# Altium schematic sheet backlight_control.SchDoc
size A4; SheetNumber: 7; SheetTotal: 13
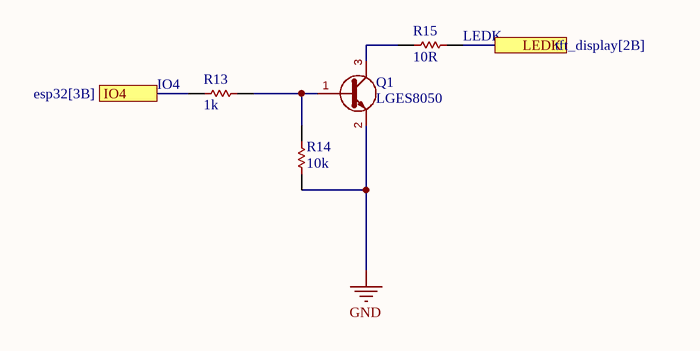
[diagram p0: backlight_control.SchDoc]

## Parts
Q1  LGES8050  [FP-SS8050-G-IPC_A]
R13  1k  [RESC2013X70X40NL20T20]
R14  10k  [RESC2013X70X40NL20T20]
R15  10R  [RESC2013X70X40NL20T20]

## Ports
IO4 (see esp32[3B]), LEDK (see tft_display[2B])

## Nets
GND: Q1.2(B) R14.1
IO4: R13.2 ; port IO4
LEDK: R15.1 ; port LEDK
NetQ1_1: Q1.1(E) R13.1 R14.2
NetQ1_3: Q1.3(C) R15.2

## Notes on the sheet
- (near R15) LEDK
- (near R13) IO4

## Library data of the parts
R13-R15 = CMP-2100-03671-1: Chip Resistor, 1 KOhm, +/- 1%, 125 mW, -55 to 155 degC, 0805 (2012 Metric), RoHS, Tape and Reel; Manufacturer: Yageo; Temperature Coefficient: 100ppm/degreesC; Voltage Rating (DC): 150V; Max Power Dissipation: 125mW; Resistance: 1KOhm; Number of Pins: 2; Number of Terminations: 2; Datasheet URL: http://www.yageo.com/NewPortal/yageodocoutput?fileName=/pdf/R-Chip/PYu-RC_Group_51_RoHS_L_5.pdf; Length: 0.079inch; Package Description: 2-Pin Surface Mounted Device, Body 2 x 1.25 mm; Depth: 1.25mm; Height: 0.024inch; Military Standard: Not; Case/Package: 0805; Package Reference: 0805; RoHSCompliant: true; Lead Free: LeadFree; Packaging: TapeandReel; Package Quantity: 1; Datasheet Version: Rev. 5, 10/2016; Tolerance: 1%; Min Operating Temperature: -55degC; Voltage Rating: 150V; Composition: ThickFilm; Case Code (Imperial): 0805; Power Rating: 125mW; Width: 0.049inch; Case Code (Metric): 2012; Manufacturer URL: http://www.yageo.com/; Max Operating Temperature: 155degC; REACH SVHC: Unknown; Termination: SMD/SMT